# Altium schematic sheet Positive Pwr.SchDoc
size A4
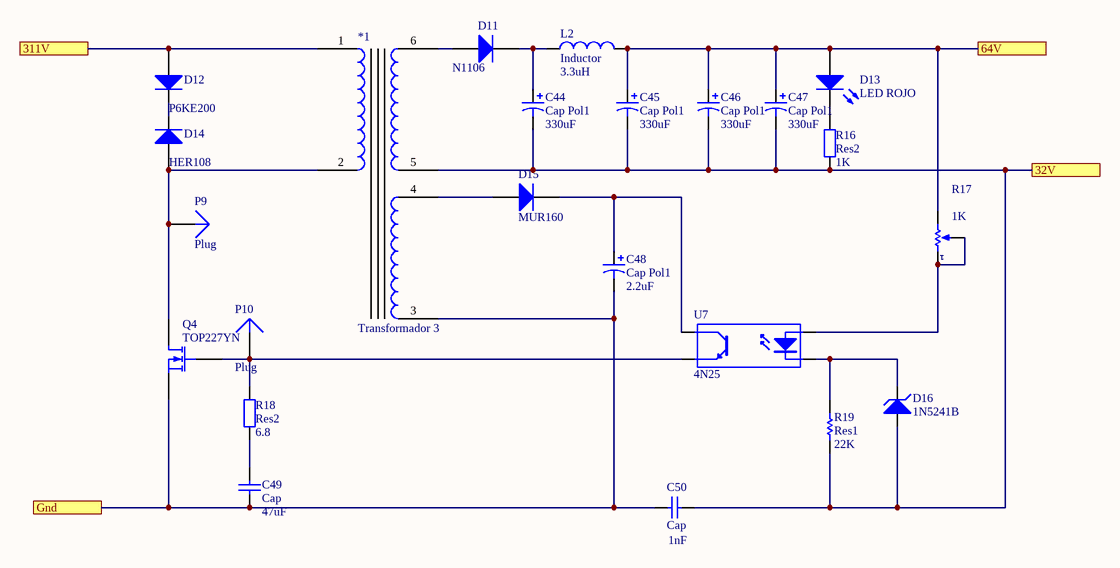
[diagram p0: Positive Pwr.SchDoc]

## Parts
*1  Transformador 3  [Transformador_flyback - duplicate]
C44  Cap Pol1  value 330uF  [CAPR D500 H1200 R200 mil]
C45  Cap Pol1  value 330uF  [CAPR D500 H1200 R200 mil]
C46  Cap Pol1  value 330uF  [CAPR D500 H1200 R200 mil]
C47  Cap Pol1  value 330uF  [CAPR D500 H1200 R200 mil]
C48  Cap Pol1  value 2.2uF  [CAPR D200 H450 R100 mil]
C49  Cap  value 47uF  [CAPR D250 H450 R100 mil]
C50  Cap  value 1nF  [RAD-0.2]
D11  N1106  [TO-220_A]
D12  P6KE200  [DO-15]
D13  LED ROJO  [Led 5mm ROJO]
D14  HER108  [DO-41]
D15  MUR160  [DO-41]
D16  VALOR: 1N5241B  [DO-41]  (hidden comment: Diodo Zener)
L2  Inductor  value 3.3uH  [Bobina 1.5*3]
P9  Plug  [PIN1]
P10  Plug  [PIN1]
Q4  TOP227YN  [TO-220AB]
R16  Res2  value 1K  [1206 resistor]
R17  VALOR: 1K  [Trimpot Horizontal]  (hidden comment: Trimpot)
R18  Res2  value 6.8  [1206 resistor]
R19  Res1  value 22K  [1206 resistor]
U7  4N25  [DIP-4]

## Ports
32V, 64V, 311V, Gnd

## Nets
32V: *1.5(L) C44.2 C45.2 C46.2 C47.2 C50.2 D16.1(A) R16.1 R19.1 ; port 32V
64V: C45.1 C46.1 C47.1 D13.1(A) L2.2 R17.2(BOT) ; port 64V
311V: *1.1(L) D12.1(A) ; port 311V
Gnd: *1.3(L) C48.2 C49.1 C50.1 Q4.2(S) ; port Gnd
Net*1_2: *1.2(L) D14.1(A) P9.1 Q4.3(D)
Net*1_4: *1.4(L) D15.1(A)
Net*1_6: *1.6(L) D11.3(A)
NetC44_1: C44.1 D11.1(K) L2.1
NetC48_1: C48.1 D15.2(K) U7.4(C)
NetC49_2: C49.2 R18.1
NetD12_2: D12.2(K) D14.2(K)
NetD13_2: D13.2(K) R16.2
NetD16_2: D16.2(K) R19.2 U7.2(K)
NetP10_1: P10.1 Q4.1(G) R18.2 U7.3(E)
NetR17_1: R17.1(TOP) R17.3(TAP) U7.1(A)

## Library data of the parts
C44-C48 = Cap Pol1: Polarized Capacitor (Radial); Published: 8-Jun-2000; LatestRevisionDate: 17-Jul-2002; LatestRevisionNote: Re-released for DXP Platform.; PackageReference: RB7.6-15; Publisher: Altium Limited; PackageDescription: Polarized Capacitor (Radial); 2 Leads
C49 C50 = Cap: Capacitor; Published: 8-Jun-2000; LatestRevisionDate: 17-Jul-2002; LatestRevisionNote: Re-released for DXP Platform.; PackageReference: RAD-0.3; Publisher: Altium Limited; PackageDescription: Radial Cap, Thru-Hole; 2 Leads; 0.3 in Pin Spacing
D11 D12 D14 D15 = Diode 1N4148: High Conductance Fast Diode; Published: 8-Jun-2000; LatestRevisionDate: 17-Jul-2002; LatestRevisionNote: Re-released for DXP Platform.; DatasheetVersion: 1997; PackageReference: DO-35; Publisher: Altium Limited; PackageDescription: Diode, Axial; Body 3.8 x 1.9 mm (LxDia. max), Lead Dia. 0.53 mm (max); Code_JEDEC: DO-204-AH; ComponentLink1Description: Manufacturer Link; ComponentLink1URL: http://www.fairchildsemi.com/; ComponentLink2Description: Datasheet; ComponentLink2URL: http://www.fairchildsemi.com/ds/1N%2F1N4148.pdf
D13 = LED0: Typical INFRARED GaAs LED; Published: 8-Jun-2000; LatestRevisionDate: 08-Jul-2005; LatestRevisionNote: Mech Layer 1 removed.; PackageReference: LED-0; Publisher: Altium Limited; PackageDescription: LED; 2 Leads
L2 = Inductor: Code_IEC: 1005; Published: 8-Jun-2000; LatestRevisionDate: 29-May-2009; LatestRevisionNote: IPC-7351 Footprint Added.; PackageReference: 0402-A; Publisher: Altium Limited; PackageDescription: Chip Inductor; Code_JEITA: 0402
Q4 = MOSFET-N: N-Channel MOSFET; Published: 8-Jun-2000; LatestRevisionDate: 17-Jul-2002; LatestRevisionNote: Re-released for DXP Platform.; PackageVersion: 1995/1996; PackageReference: E3; Publisher: Altium Limited; PackageDescription: TO, Flat Index; 3 In-Line, Axial Leads; Body Dia. 4.6mm; Lead Dia. 0.5 mm (max)
R16 R18 = Res2: Resistor; Published: 8-Jun-2000; LatestRevisionDate: 17-Jul-2002; LatestRevisionNote: Re-released for DXP Platform.; PackageReference: AXIAL-0.4; Publisher: Altium Limited; PackageDescription: Axial Device, Thru-Hole; 2 Leads; 0.4 in Pin Spacing
R17 = Trimpot: Preset; CODIGO STI: *; PROVEEDOR: *; FABRICANTE: *
R19 = Res1: Resistor; Published: 8-Jun-2000; LatestRevisionDate: 17-Jul-2002; LatestRevisionNote: Re-released for DXP Platform.; PackageReference: AXIAL-0.3; Publisher: Altium Limited; PackageDescription: Axial Device, Thru-Hole; 2 Leads; 0.3 in Pin Spacing
U7 = Optoisolator1: 4-Pin Phototransistor Optocoupler; Published: 24-Mar-1999; LatestRevisionDate: 04-Mar-2005; LatestRevisionNote: Sch pins 3 & 4 Swapped.; DatasheetVersion: Nov-2003; PackageReference: DIP-4; Publisher: Altium Limited
D16 = Diodo Zener: CODIGO STI: *; PROVEEDOR: *; FABRICANTE: *
P9 P10 = Plug: LatestRevisionDate: 17-Jul-2002; LatestRevisionNote: Re-released for DXP Platform.; Publisher: Altium Limited